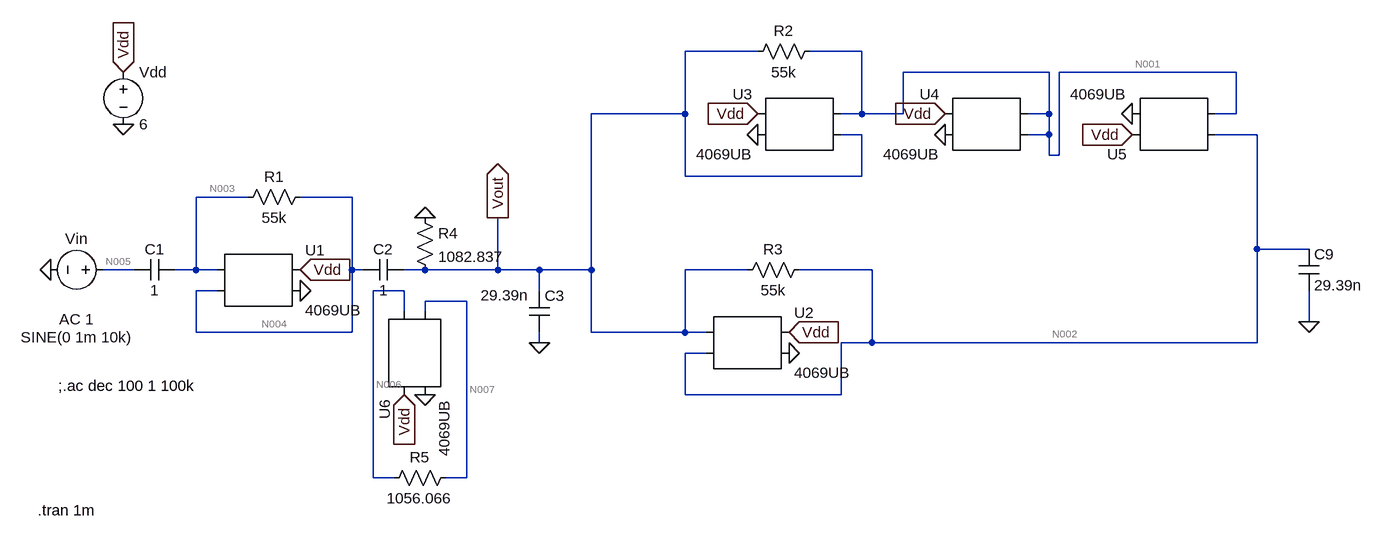
[diagram p0: schematic Q2adv.asc]
* Q2adv.asc
* U1: 4069UB (symbol AutoGenerated\4069UB not available, pins judged from their places): pin1=N003 pin2=N004 pin3=Vdd pin4=0
Vin N005 0 SINE(0 1m 10k) AC 1
C3 Vout 0 29.39n
* U2: 4069UB (symbol AutoGenerated\4069UB not available, pins judged from their places): pin1=Vout pin2=N002 pin3=Vdd pin4=0
* U3: 4069UB (symbol AutoGenerated\4069UB not available, pins judged from their places): pin1=N001 pin2=Vout pin3=Vdd pin4=0
* U4: 4069UB (symbol AutoGenerated\4069UB not available, pins judged from their places): pin1=N001 pin2=N001 pin3=Vdd pin4=0
* U5: 4069UB (symbol AutoGenerated\4069UB not available, pins judged from their places): pin1=N002 pin2=N001 pin3=Vdd pin4=0
Vdd Vdd 0 6
C9 N002 0 29.39n
* U6: 4069UB (symbol AutoGenerated\4069UB not available, pins judged from their places): pin1=N006 pin2=N007 pin3=Vdd pin4=0
R1 N004 N003 55k
R2 N001 Vout 55k
R3 N002 Vout 55k
R5 N007 N006 1056.066
C1 N003 N005 1
C2 Vout N004 1
R4 0 Vout 1082.837
;.ac dec 100 1 100k
.tran 1m
.backanno
.end

* Results of the author's LTspice run, read from the files saved beside the schematic
* Operating Point, zero values left out:
*   V(n004) = 2.563 V
*   V(n003) = 2.563 V
*   V(vdd) = 6 V
*   V(vout) = 2.548 V
*   V(n002) = 4.01 V
*   V(n001) = 1.23 V
*   V(n007) = 2.563 V
*   V(n006) = 2.563 V
*   I(C1) = 2.563 pA
*   I(R4) = -2.353 mA
*   I(R3) = 26.59 µA
*   I(R2) = -23.96 µA
*   I(R1) = 2.563 pA
*   I(Vdd) = -5.474 mA
*   I(Vin) = 2.563 pA
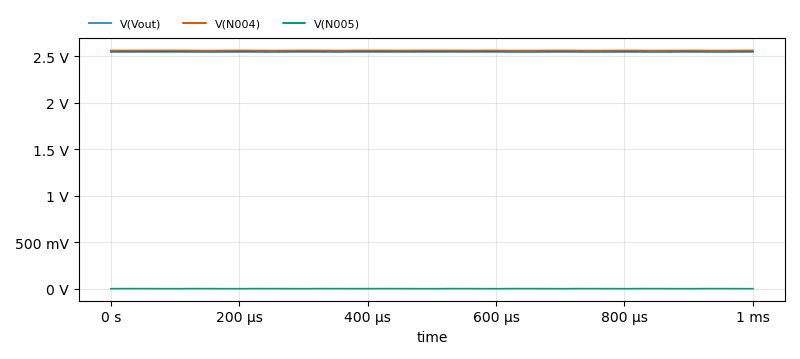
[diagram p1: Transient Analysis of Q2adv.asc, plotted from the saved traces]
* Transient Analysis, 1 run:
*   V(Vout): min 2.546 V, max 2.549 V, average 2.548 V, rms 2.548 V, last 2.549 V
*   V(N004): min 2.561 V, max 2.564 V, average 2.563 V, rms 2.563 V, last 2.564 V
*   V(N005): min -1 mV, max 1 mV, average 14.49 nV, rms 707.1 µV, last 0 V